# EAGLE schematic sensors_actuators_shieldv1.1 (EAGLE 6.5.0)
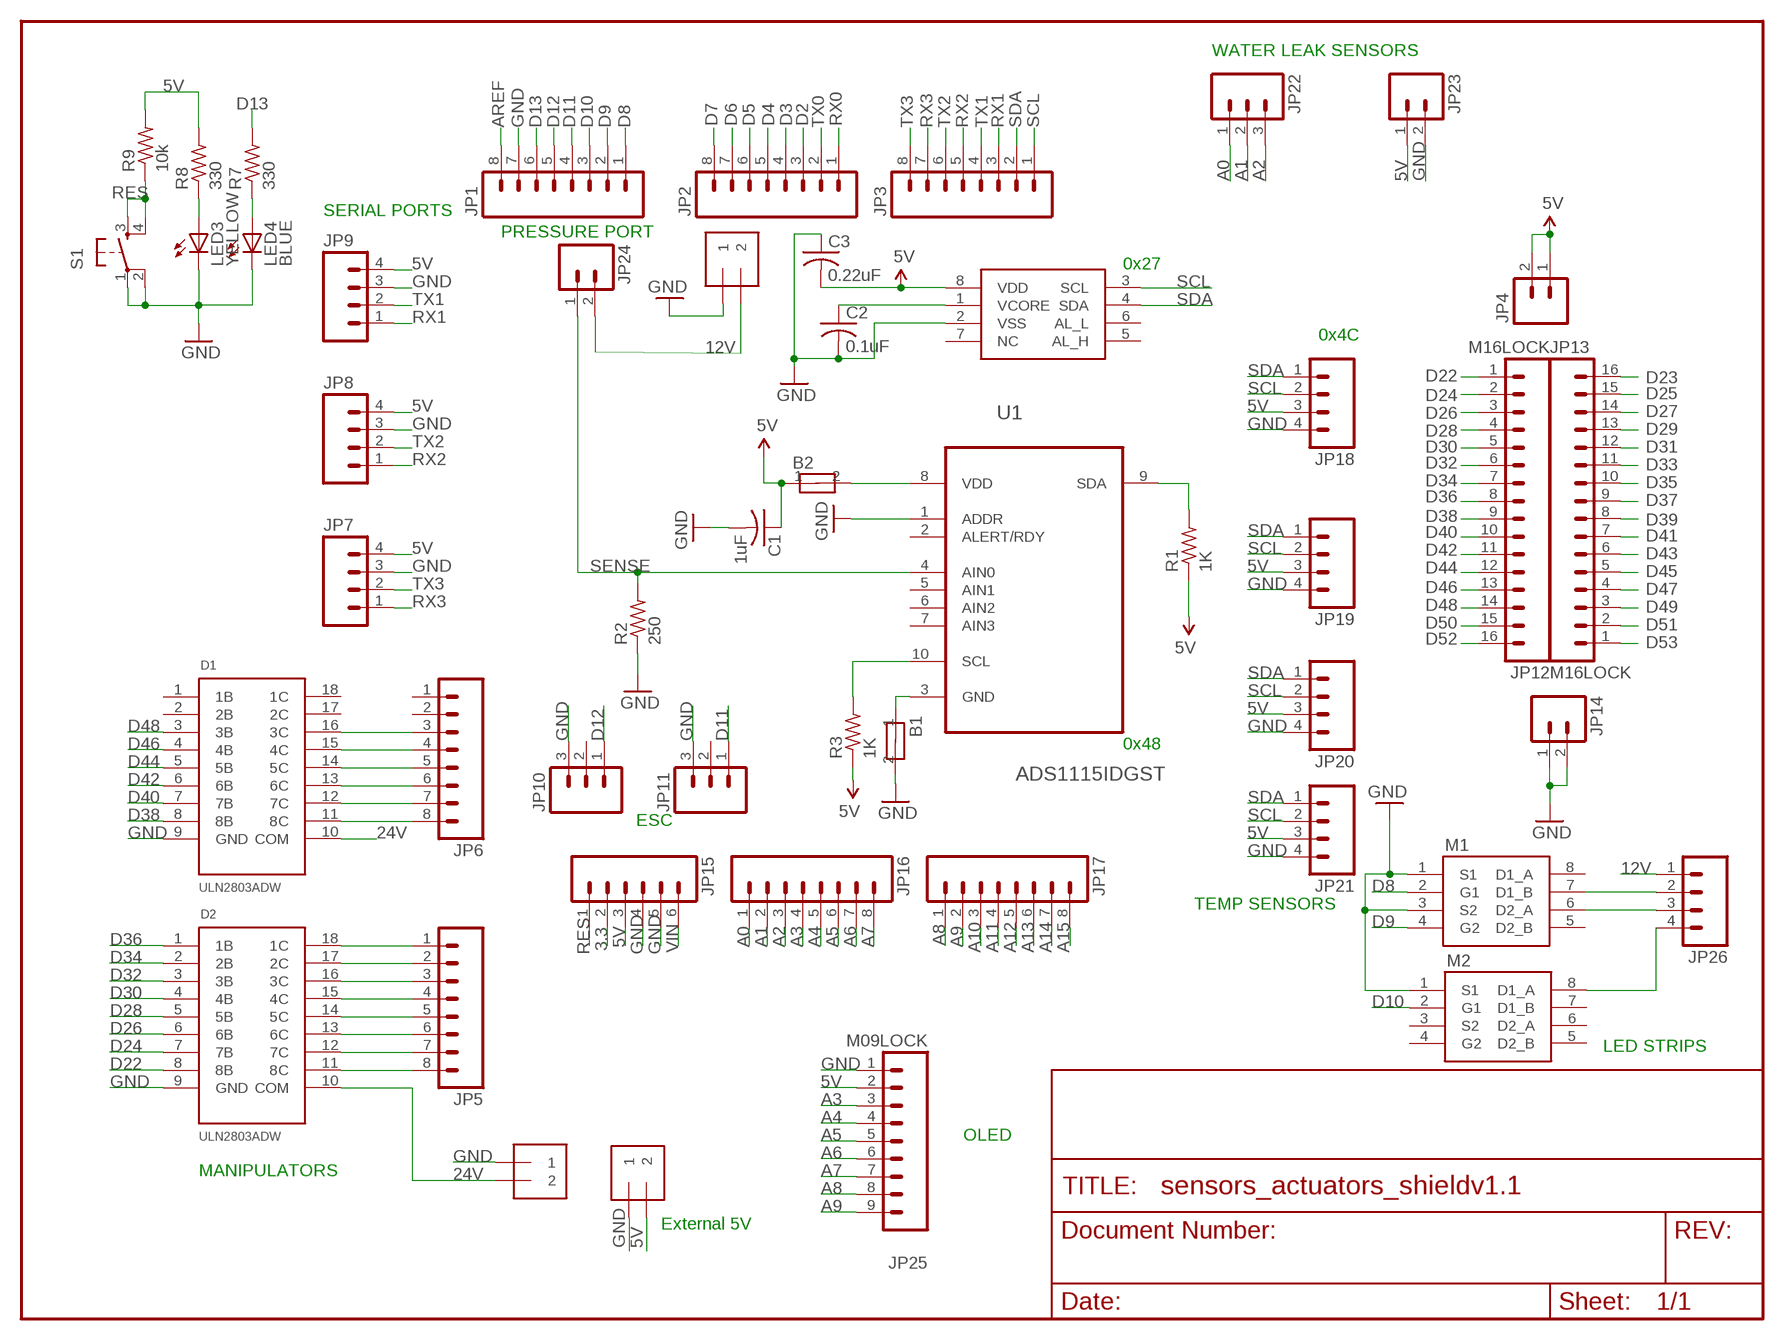
[diagram p0: schematic, sheet 1]

## Parts
B1  MMZ2012Y152B0.4OHM,500MA  [0805]
B2  MMZ2012Y152B0.4OHM,500MA  [0805]
C1  1uF  C-USC0805  [C0805]
C2  0.1uF  C-USC0805  [C0805]
C3  0.22uF  C-USC0805  [C0805]
D1  ULN2803ADW  [SOIC]
D2  ULN2803ADW  [SOIC]
J1  1X2-3.5MM  [1X2-3.5MM]
J2  1X2-3.5MM  [1X2-3.5MM]
J3  1X2-3.5MM  [1X2-3.5MM]
JP1  M08LOCK  [1X08_LOCK]
JP2  M08LOCK  [1X08_LOCK]
JP3  M08LOCK  [1X08_LOCK]
JP4  M02LOCK  [1X02_LOCK]
JP5  M08LOCK  [1X08_LOCK]
JP6  M08LOCK  [1X08_LOCK]
JP7  M04LOCK  [1X04_LOCK]
JP8  M04LOCK  [1X04_LOCK]
JP9  M04LOCK  [1X04_LOCK]
JP10  M03LOCK  [1X03_LOCK]
JP11  M03LOCK  [1X03_LOCK]
JP12  M16LOCK  [1X16_LOCK]
JP13  M16LOCK  [1X16_LOCK]
JP14  M02LOCK  [1X02_LOCK]
JP15  M06LOCK  [1X06_LOCK]
JP16  M08LOCK  [1X08_LOCK]
JP17  M08LOCK  [1X08_LOCK]
JP18  M04LOCK  [1X04_LOCK]
JP19  M04LOCK  [1X04_LOCK]
JP20  M04LOCK  [1X04_LOCK]
JP21  M04LOCK  [1X04_LOCK]
JP22  M03LOCK  [1X03_LOCK]
JP23  M02LOCK  [1X02_LOCK]
JP24  M02LOCK  [1X02_LOCK]
JP25  M09LOCK  [1X09_LOCK]
JP26  M04LOCK  [1X04_LOCK]
LED3  YELLOW  LEDCHIPLED_0805  [CHIPLED_0805]
LED4  BLUE  LEDCHIPLED_0805  [CHIPLED_0805]
M1  IRF7910PBF  [SO-8]
M2  IRF7910PBF  [SO-8]
R1  1K  R-US_M0805  [M0805]
R2  250  R-US_M0805  [M0805]
R3  1K  R-US_M0805  [M0805]
R7  330  R-US_M0805  [M0805]
R8  330  R-US_M0805  [M0805]
R9  10k  R-US_M0805  [M0805]
S1  TAC_SWITCHPTH  [TACTILE-PTH]
U1  ADS1115IDGST  [SOP50P490X110-10N]
U$2  HIH6130  [SO-8]

## Nets
3.3: JP15.2
5V: B2.1 C1.1 C3.2 J3.2 JP4.1 JP4.2 JP7.4 JP8.4 JP9.4 JP15.3 JP18.3 JP19.3 JP20.3 JP21.3 JP23.1 JP25.2 R1.1 R3.1 R8.2 R9.2 U$2.8(VDD)
12V: J1.2 JP24.2 JP26.1
24V: D1.10(COM) D2.10(COM) J2.2
A0: JP16.1 JP22.1
A1: JP16.2 JP22.2
A2: JP16.3 JP22.3
A3: JP16.4 JP25.3
A4: JP16.5 JP25.4
A5: JP16.6 JP25.5
A6: JP16.7 JP25.6
A7: JP16.8 JP25.7
A8: JP17.1 JP25.8
A9: JP17.2 JP25.9
A10: JP17.3
A11: JP17.4
A12: JP17.5
A13: JP17.6
A14: JP17.7
A15: JP17.8
AREF: JP1.8
D2: JP2.3
D3: JP2.4
D4: JP2.5
D5: JP2.6
D6: JP2.7
D7: JP2.8
D8: JP1.1 M1.2(G1)
D9: JP1.2 M1.4(G2)
D10: JP1.3 M2.2(G1)
D11: JP1.4 JP11.1
D12: JP1.5 JP10.1
D13: JP1.6 R7.2
D22: D2.8(8B) JP12.1
D23: JP13.16
D24: D2.7(7B) JP12.2
D25: JP13.15
D26: D2.6(6B) JP12.3
D27: JP13.14
D28: D2.5(5B) JP12.4
D29: JP13.13
D30: D2.4(4B) JP12.5
D31: JP13.12
D32: D2.3(3B) JP12.6
D33: JP13.11
D34: D2.2(2B) JP12.7
D35: JP13.10
D36: D2.1(1B) JP12.8
D37: JP13.9
D38: D1.8(8B) JP12.9
D39: JP13.8
D40: D1.7(7B) JP12.10
D41: JP13.7
D42: D1.6(6B) JP12.11
D43: JP13.6
D44: D1.5(5B) JP12.12
D45: JP13.5
D46: D1.4(4B) JP12.13
D47: JP13.4
D48: D1.3(3B) JP12.14
D49: JP13.3
D50: JP12.15
D51: JP13.2
D52: JP12.16
D53: JP13.1
GND: B1.2 C1.2 C2.2 C3.1 D1.9(GND) D2.9(GND) J1.1 J2.1 J3.1 JP1.7 JP7.3 JP8.3 JP9.3 JP10.3 JP11.3 JP14.1 JP14.2 JP15.4 JP15.5 JP18.4 JP19.4 JP20.4 JP21.4 JP23.2 JP25.1 LED3.C LED4.C M1.1(S1) M1.3(S2) M2.1(S1) R2.1 S1.1 S1.2 U1.1(ADDR) U$2.2(VSS)
N$3: D1.16(3C) JP6.3
N$4: D1.15(4C) JP6.4
N$5: R1.2 U1.9(SDA)
N$6: B1.1 U1.3(GND)
N$7: D1.14(5C) JP6.5
N$8: D1.13(6C) JP6.6
N$9: D1.12(7C) JP6.7
N$10: D1.11(8C) JP6.8
N$11: D2.18(1C) JP5.1
N$12: D2.17(2C) JP5.2
N$13: D2.14(5C) JP5.5
N$14: D2.15(4C) JP5.4
N$15: D2.11(8C) JP5.8
N$16: D2.13(6C) JP5.6
N$17: D2.12(7C) JP5.7
N$18: JP26.2 M1.7(D1_B)
N$19: D2.16(3C) JP5.3
N$20: JP26.3 M1.6(D2_A)
N$21: JP26.4 M2.8(D1_A)
N$22: R3.2 U1.10(SCL)
N$23: C2.1 U$2.1(VCORE)
N$24: B2.2 U1.8(VDD)
N$126: LED3.A R8.1
N$127: LED4.A R7.1
RES: JP15.1 R9.1 S1.3 S1.4
RX0: JP2.1
RX1: JP3.3 JP9.1
RX2: JP3.5 JP8.1
RX3: JP3.7 JP7.1
SCL: JP3.1 JP18.2 JP19.2 JP20.2 JP21.2 U$2.3(SCL)
SDA: JP3.2 JP18.1 JP19.1 JP20.1 JP21.1 U$2.4(SDA)
SENSE: JP24.1 R2.2 U1.4(AIN0)
TX0: JP2.2
TX1: JP3.4 JP9.2
TX2: JP3.6 JP8.2
TX3: JP3.8 JP7.2
VIN: JP15.6
Unconnected: D1.1(1B) D1.2(2B) D1.17(2C) D1.18(1C) JP6.1 JP6.2 JP10.2 JP11.2 M1.5(D2_B) M1.8(D1_A) M2.3(S2) M2.4(G2) M2.5(D2_B) M2.6(D2_A) M2.7(D1_B) U1.2(ALERT/RDY) U1.5(AIN1) U1.6(AIN2) U1.7(AIN3) U$2.5(AL_H) U$2.6(AL_L) U$2.7(NC)

## Notes on the sheet
- WATER LEAK SENSORS
- SERIAL PORTS
- PRESSURE PORT
- 0x27
- 0x4C
- 0x48
- ESC
- TEMP SENSORS
- LED STRIPS
- OLED
- MANIPULATORS
- External 5V

## Library data of the parts
B1 B2 = bbauv:MMZ2012Y152B; DCCURRENT: 500mA; DCRESIST: 0.4ohm; MPN: MMZ2012Y152B; OC_NEWARK: 89R3127
C1 = adafruit:C-US: CAPACITOR, American symbol; MF: KEMET; MPN: C0805C105M4RACTU; OC_NEWARK: 42H5473
C2 = adafruit:C-US: CAPACITOR, American symbol; MPN: 08055C104K4Z2A; OC_NEWARK: 10R5977
C3 = adafruit:C-US: CAPACITOR, American symbol; MPN: CGA4J2X8R1E224K125AA; OC_NEWARK: 52W9749
D1 D2 = bbauv:ULN2803ADW: The ULN2803A is a high-voltage, high-current Darlington transistor array. The device consists of eight npn Darlington pairs that feature high-voltage outputs with common-cathode clamp diodes for switching inductive loads. The collector-current rating of each Darlington pair is 500 mA. The Darlington pairs may be connected in parallel for higher current capability. Applications include relay drivers, hammer drivers, lamp drivers, display drivers (LED and gas discharge), line drivers, and logic buffers. The ULN2803A has a 2.7-kΩ series base resistor for each Darlington pair for operation directly with TTL or 5-V CMOS devices.; MF: TEXAS INSTRUMENTS; MPN: ULN2803ADW; OC_NEWARK: 69K0711
J1-J3 = adafruit:1X2: 3.5mm Terminal block http://www.ladyada.net/library/pcb/eaglelibrary.html; MPN: 691103110002; OC_NEWARK: 16T1476
JP1-JP3 JP5 JP6 JP16 JP17 = SparkFun:M08: Header 8 Standard 8-pin 0.1" header. Use with straight break away headers (SKU : PRT-00116), right angle break away headers (PRT-00553), swiss pins (PRT-00743), machine pins (PRT-00117), and female headers (PRT-00115).; OC_NEWARK: unknown
JP4 JP14 JP23 JP24 = SparkFun:M02: Header 2 Standard 2-pin 0.1" header. Use with straight break away headers (SKU : PRT-00116), right angle break away headers (PRT-00553), swiss pins (PRT-00743), machine pins (PRT-00117), and female headers (PRT-00115). Molex polarized connector foot print use with SKU : PRT-08233 with associated crimp pins and housings.; OC_NEWARK: unknown
JP7-JP9 JP18-JP21 JP26 = SparkFun-Connectors:M04: Header 4 Standard 4-pin 0.1" header. Use with straight break away headers (SKU : PRT-00116), right angle break away headers (PRT-00553), swiss pins (PRT-00743), machine pins (PRT-00117), and female headers (PRT-00115). Molex polarized connector foot print use with SKU : PRT-08231 with associated crimp pins and housings. 1MM SMD Version SKU: PRT-10208; OC_NEWARK: unknown
JP10 JP11 JP22 = SparkFun-Connectors:M03: Header 3 Standard 3-pin 0.1" header. Use with straight break away headers (SKU : PRT-00116), right angle break away headers (PRT-00553), swiss pins (PRT-00743), machine pins (PRT-00117), and female headers (PRT-00115). Molex polarized connector foot print use with SKU : PRT-08232 with associated crimp pins and housings.; OC_NEWARK: unknown
JP12 JP13 = SparkFun:M16; OC_NEWARK: unknown
JP15 = SparkFun:M06: Header 6 Standard 6-pin 0.1" header. Use with straight break away headers (SKU : PRT-00116), right angle break away headers (PRT-00553), swiss pins (PRT-00743), machine pins (PRT-00117), and female headers (PRT-00115). Molex polarized connector foot print use with SKU : PRT-08094 with associated crimp pins and housings. NOTES ON THE VARIANTS LOCK and LOCK_LONGPADS... This footprint was designed to help hold the alignment of a through-hole component (i.e. 6-pin header) while soldering it into place. You may notice that each hole has been shifted either up or down by 0.005 of an inch from it's more standard position (which is a perfectly straight line). This slight alteration caused the pins (the squares in the middle) to touch the edges of the holes. Because they are alternating, it causes a "brace" to hold the component in place. 0.005 has proven to be the perfect amount of "off-center" position when using our standard breakaway headers. Although looks a little odd when you look at the bare footprint, once you have a header in there, the alteration is very hard to notice. Also, if you push a header all the way into place, it is covered up entirely on the bottom side. This idea of altering the position of holes to aid alignment will be further integrated into the Sparkfun Library for other footprints. It can help hold any component with 3 or more connection pins.; OC_NEWARK: unknown
JP25 = SparkFun-Connectors:M09: Header 9 Standard 9-pin 0.1" header. Use with straight break away headers (SKU : PRT-00116), right angle break away headers (PRT-00553), swiss pins (PRT-00743), machine pins (PRT-00117), and female headers (PRT-00115).; OC_NEWARK: unknown
LED3 = adafruit:LED: LED OSRAM: - CHIPLED LG R971, LG N971, LY N971, LG Q971, LY Q971, LO R971, LY R971 LH N974, LH R974 LS Q976, LO Q976, LY Q976 LO Q996 - Hyper CHIPLED LW Q18S LB Q993, LB Q99A, LB R99A - SideLED LS A670, LO A670, LY A670, LG A670, LP A670 LB A673, LV A673, LT A673, LW A673 LH A674 LY A675 LS A676, LA A676, LO A676, LY A676, LW A676 LS A679, LY A679, LG A679 - Hyper Micro SIDELED® LS Y876, LA Y876, LO Y876, LY Y876 LT Y87S - SmartLED LW L88C, LW L88S LB L89C, LB L89S, LG L890 LS L89K, LO L89K, LY L89K LS L896, LA L896, LO L896, LY L896 - TOPLED LS T670, LO T670, LY T670, LG T670, LP T670 LSG T670, LSP T670, LSY T670, LOP T670, LYG T670 LG T671, LOG T671, LSG T671 LB T673, LV T673, LT T673, LW T673 LH T674 LS T676, LA T676, LO T676, LY T676, LB T676, LH T676, LSB T676, LW T676 LB T67C, LV T67C, LT T67C, LS T67K, LO T67K, LY T67K, LW E67C LS E67B, LA E67B, LO E67B, LY E67B, LB E67C, LV E67C, LT E67C LW T67C LS T679, LY T679, LG T679 LS T770, LO T770, LY T770, LG T770, LP T770 LB T773, LV T773, LT T773, LW T773 LH T774 LS E675, LA E675, LY E675, LS T675 LS T776, LA T776, LO T776, LY T776, LB T776 LHGB T686 LT T68C, LB T68C - Hyper Mini TOPLED® LB M676 - Mini TOPLED Santana® LG M470 LS M47K, LO M47K, LY M47K Source: http://www.osram.convergy.de/; MPN: KP-2012SYCK-J3; OC_NEWARK: 96W6948
LED4 = adafruit:LED: LED OSRAM: - CHIPLED LG R971, LG N971, LY N971, LG Q971, LY Q971, LO R971, LY R971 LH N974, LH R974 LS Q976, LO Q976, LY Q976 LO Q996 - Hyper CHIPLED LW Q18S LB Q993, LB Q99A, LB R99A - SideLED LS A670, LO A670, LY A670, LG A670, LP A670 LB A673, LV A673, LT A673, LW A673 LH A674 LY A675 LS A676, LA A676, LO A676, LY A676, LW A676 LS A679, LY A679, LG A679 - Hyper Micro SIDELED® LS Y876, LA Y876, LO Y876, LY Y876 LT Y87S - SmartLED LW L88C, LW L88S LB L89C, LB L89S, LG L890 LS L89K, LO L89K, LY L89K LS L896, LA L896, LO L896, LY L896 - TOPLED LS T670, LO T670, LY T670, LG T670, LP T670 LSG T670, LSP T670, LSY T670, LOP T670, LYG T670 LG T671, LOG T671, LSG T671 LB T673, LV T673, LT T673, LW T673 LH T674 LS T676, LA T676, LO T676, LY T676, LB T676, LH T676, LSB T676, LW T676 LB T67C, LV T67C, LT T67C, LS T67K, LO T67K, LY T67K, LW E67C LS E67B, LA E67B, LO E67B, LY E67B, LB E67C, LV E67C, LT E67C LW T67C LS T679, LY T679, LG T679 LS T770, LO T770, LY T770, LG T770, LP T770 LB T773, LV T773, LT T773, LW T773 LH T774 LS E675, LA E675, LY E675, LS T675 LS T776, LA T776, LO T776, LY T776, LB T776 LHGB T686 LT T68C, LB T68C - Hyper Mini TOPLED® LB M676 - Mini TOPLED Santana® LG M470 LS M47K, LO M47K, LY M47K Source: http://www.osram.convergy.de/; MPN: 150080BS75000; OC_NEWARK: 95W3799
M1 M2 = bbauv:IRF7910: POWER MOSFETS High Frequency 3.3V and 5V input Point- of-Load Synchronous Buck Converters for Netcom and Computing Applications Power Management for Netcom, Computing and Portable Applications Lead-Free; MPN: IRF7910PBF; OC_NEWARK: 97K2234
R1 R3 = adafruit:R-US_: RESISTOR, American symbol; MF: VISHAY/DALE; MPN: CRCW08051K00FKTA; OC_NEWARK: 05F1507
R2 = adafruit:R-US_: RESISTOR, American symbol; MPN: PLTT0805Z2500AGTS; OC_NEWARK: 06X6591
R7 R8 = adafruit:R-US_: RESISTOR, American symbol; OC_NEWARK: unknown
R9 = adafruit:R-US_: RESISTOR, American symbol; MPN: MCTF0805DTC1002; OC_NEWARK: 01P2111
S1 = SparkFun:TAC_SWITCH: Momentary Switch Button commonly used for reset or general input. Spark Fun Electronics SKU : COM-00097; OC_NEWARK: unknown
U1 = bbauv:ADS1115IDGST: Analog-to-Digital Converter with Internal Reference; MPN: ADS1115IDGST; OC_FARNELL: 1762981; OC_NEWARK: 25R1241; PACKAGE: MSOP-10; SUPPLIER: Texas Instruments
U$2 = bbauv:HIH6130: Honeywell HumidIcon™ Digital Humidity/Temperature Sensors: HIH6130/6131 and HIH6120/6121 Series Honeywell HumidIcon™ Digital Humidity/Temperature Sensors: HIH6130/6131 and 6120/6121 Series is a digital output-type relative humidity (RH) and temperature sensor combined in the same package.; MPN: HIH6131-021-001; OC_NEWARK: 55T1170

## Net classes
0 default: width 0.178 mm, drill 0.508 mm, clearance 0.152 mm
1 power: width 0.203 mm, drill 0.508 mm, clearance 1.27 mm